# EAGLE design regelschaltplan (EAGLE 9.1.3)

## Sheet 1 of 5
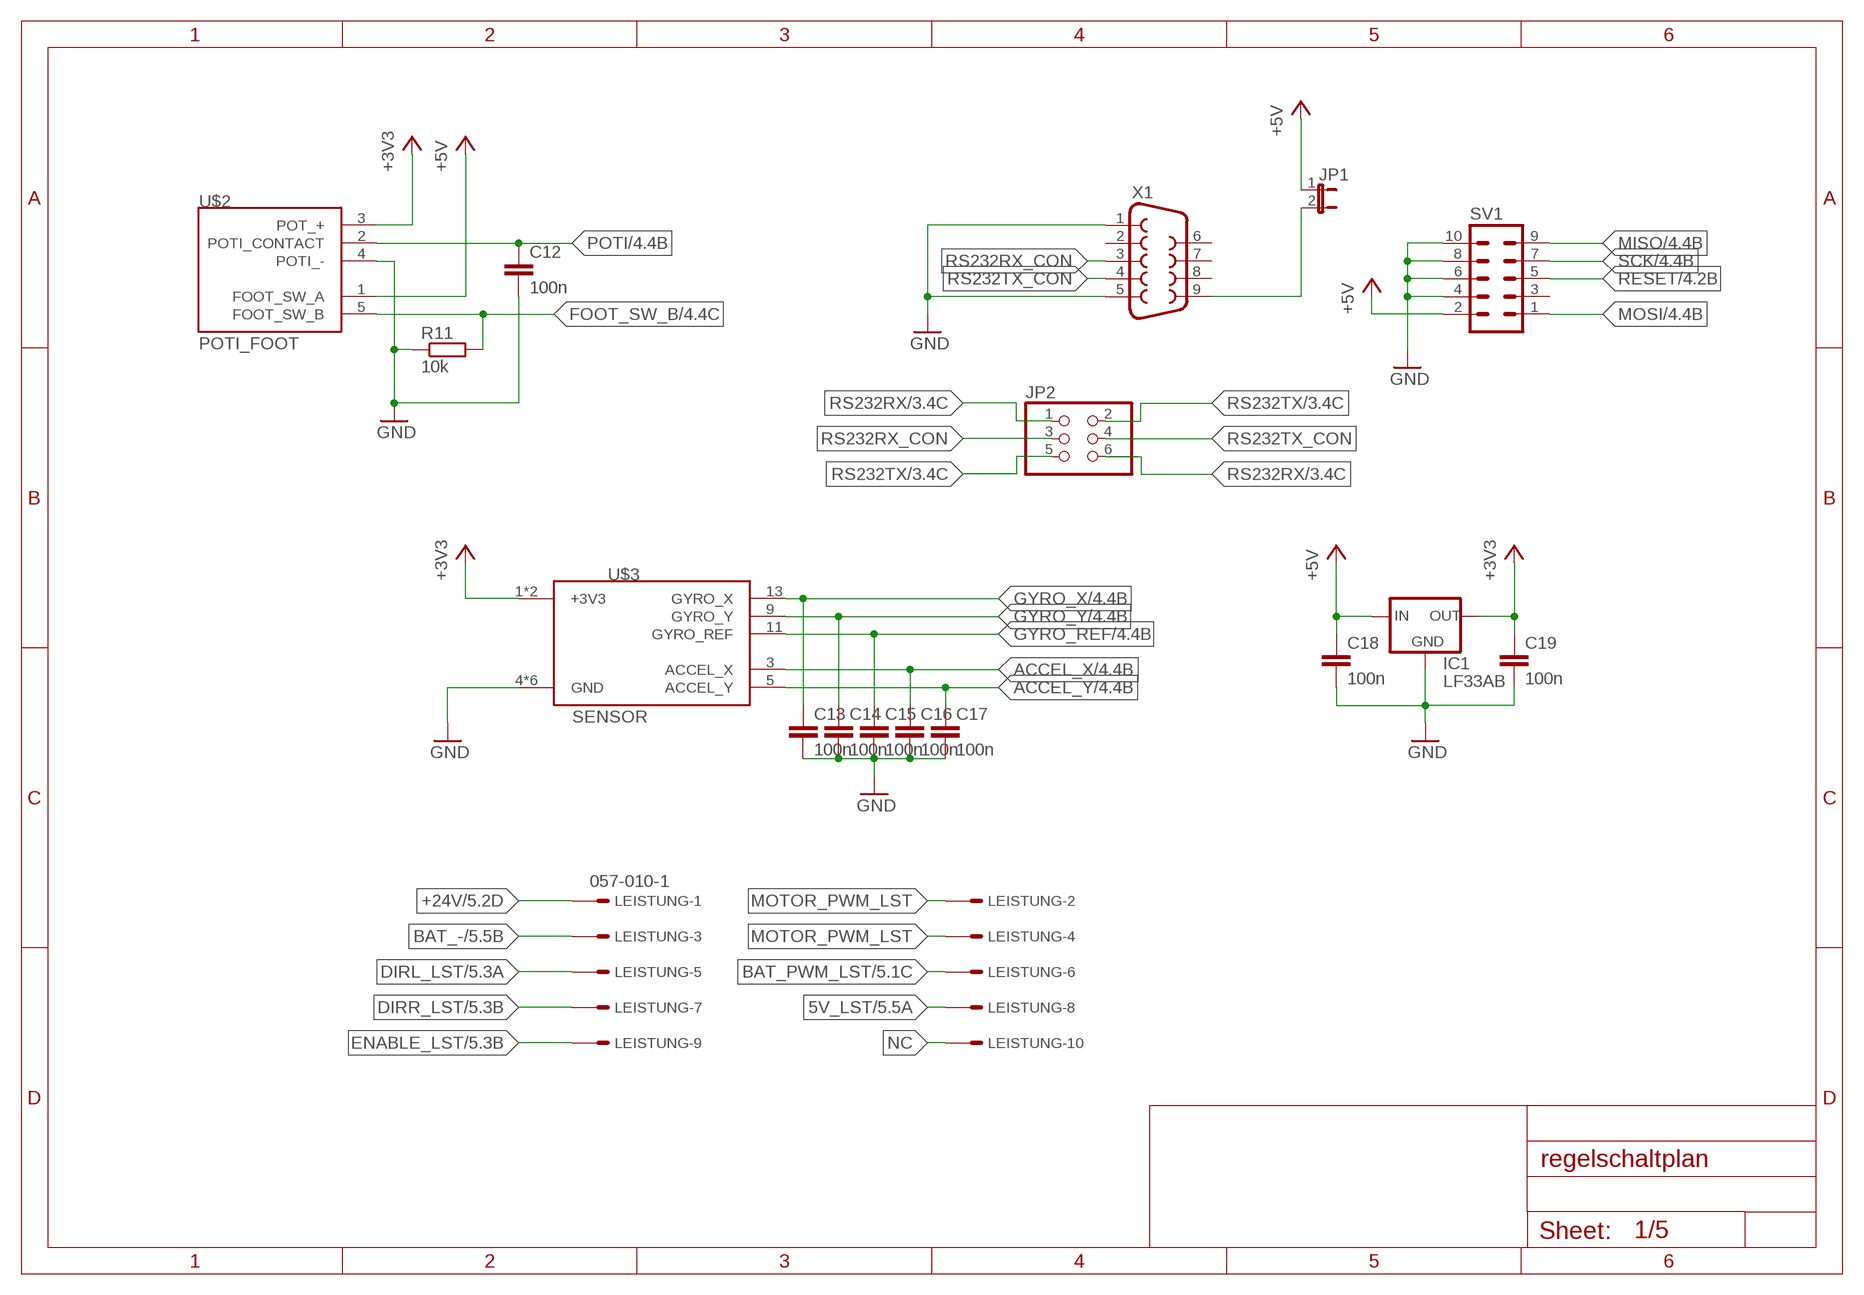
[diagram p0: schematic, sheet 1]

### Parts
C12  100n  C-EU025-025X050  [C025-025X050]
C13  100n  C-EU025-025X050  [C025-025X050]
C14  100n  C-EU025-025X050  [C025-025X050]
C15  100n  C-EU025-025X050  [C025-025X050]
C16  100n  C-EU025-025X050  [C025-025X050]
C17  100n  C-EU025-025X050  [C025-025X050]
C18  100n  C-EU025-025X050  [C025-025X050]
C19  100n  C-EU025-025X050  [C025-025X050]
IC1  LF33AB  [TO220]
JP1  JP1E  [JP1]
JP2  PINHD-2X3  [2X03]
LEISTUNG  057-010-1  [057-010-1]
R11  10k  R-EU_0207/7  [0207/7]
SV1  MA05-2  [MA05-2]
U$2  POTI_FOOT  [CON_6]
U$3  SENSOR  [CON_14]
X1  F09HP  [F09HP]

### Nets
5V_LST: LEISTUNG.8 ; also sheet 5
+3V3: C19.1 IC1.3(OUT) U$2.3(POT_+) U$3.1(+3V3) U$3.2(+3V3) ; also sheet 2,4
+5V: C18.1 IC1.1(IN) JP1.1 SV1.2 U$2.1(FOOT_SW_A) ; also sheet 2,3,4,5
+24V: LEISTUNG.1 ; also sheet 5
ACCEL_X: C16.1 U$3.3(ACCEL_X) ; also sheet 4
ACCEL_Y: C17.1 U$3.5(ACCEL_Y) ; also sheet 4
BAT_-: LEISTUNG.3 ; also sheet 5
BAT_PWM_LST: LEISTUNG.6 ; also sheet 5
DIRL_LST: LEISTUNG.5 ; also sheet 5
DIRR_LST: LEISTUNG.7 ; also sheet 5
ENABLE_LST: LEISTUNG.9 ; also sheet 5
FOOT_SW_B: R11.2 U$2.5(FOOT_SW_B) ; also sheet 4
GND: C12.2 C13.2 C14.2 C15.2 C16.2 C17.2 C18.2 C19.2 IC1.2(GND) R11.1 SV1.4 SV1.6 SV1.8 SV1.10 U$2.4(POTI_-) U$3.4(GND) U$3.6(GND) U$3.8(GND) U$3.10(GND) U$3.12(GND) U$3.14(GND) X1.1 X1.5 ; also sheet 2,3,4,5
GYRO_REF: C15.1 U$3.11(GYRO_REF) ; also sheet 4
GYRO_X: C13.1 U$3.13(GYRO_X) ; also sheet 4
GYRO_Y: C14.1 U$3.9(GYRO_Y) ; also sheet 4
MISO: SV1.9 ; also sheet 4
MOSI: SV1.1 ; also sheet 4
MOTOR_PWM_LST: LEISTUNG.2 LEISTUNG.4
N$45: JP1.2 X1.9
NC: LEISTUNG.10
POTI: C12.1 U$2.2(POTI_CONTACT) ; also sheet 4
RESET: SV1.5 ; also sheet 4
RS232RX: JP2.1 JP2.6 ; also sheet 3
RS232RX_CON: JP2.3 X1.3
RS232TX: JP2.2 JP2.5 ; also sheet 3
RS232TX_CON: JP2.4 X1.4
SCK: SV1.7 ; also sheet 4
Unconnected: SV1.3 X1.2 X1.6 X1.7 X1.8

## Sheet 2 of 5
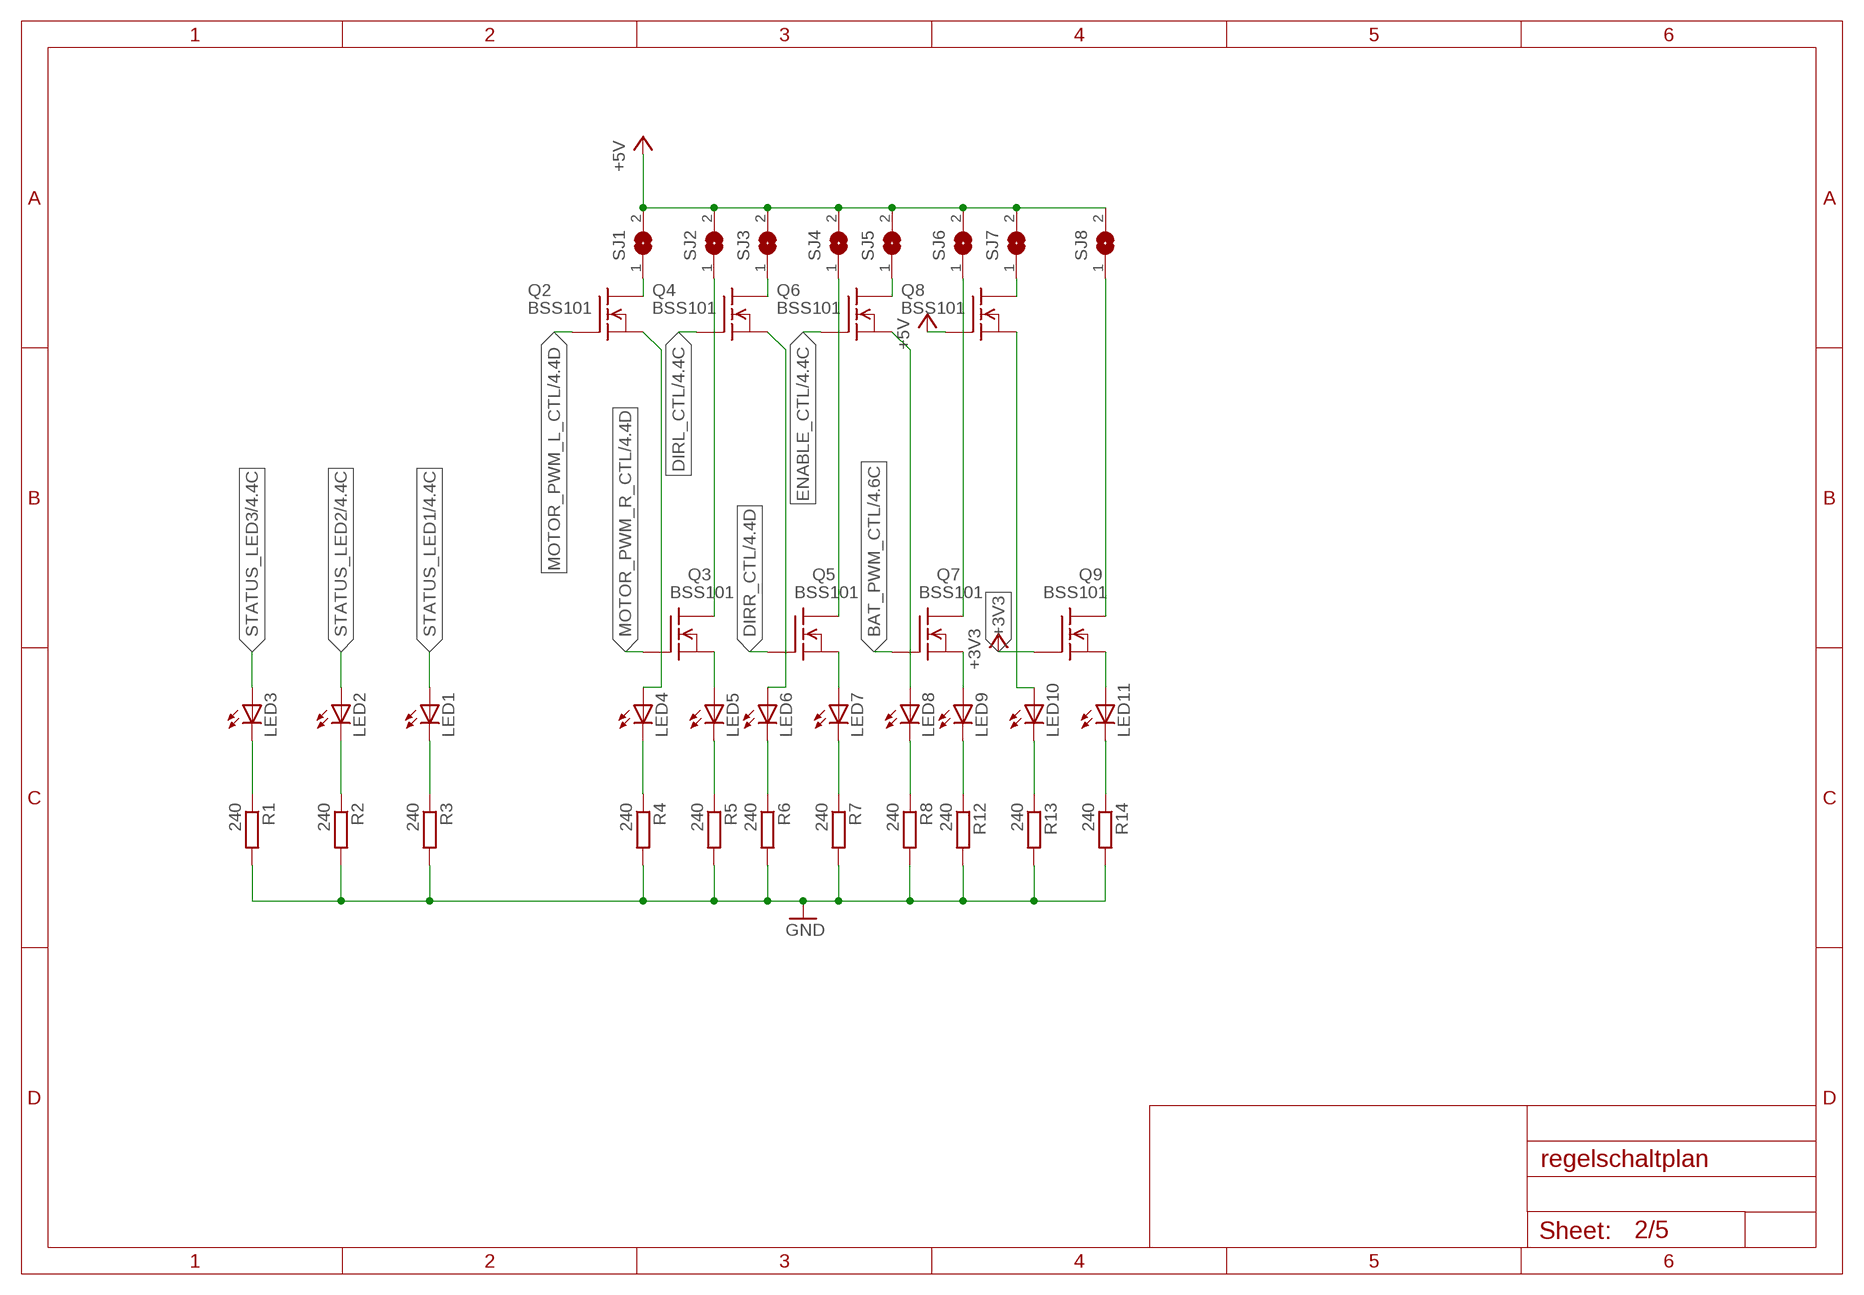
[diagram p1: schematic, sheet 2]

### Parts
LED1  LED3MM  [LED3MM]
LED2  LED3MM  [LED3MM]
LED3  LED3MM  [LED3MM]
LED4  LED3MM  [LED3MM]
LED5  LED3MM  [LED3MM]
LED6  LED3MM  [LED3MM]
LED7  LED3MM  [LED3MM]
LED8  LED3MM  [LED3MM]
LED9  LED3MM  [LED3MM]
LED10  LED3MM  [LED3MM]
LED11  LED3MM  [LED3MM]
Q2  BSS101  [TO92]
Q3  BSS101  [TO92]
Q4  BSS101  [TO92]
Q5  BSS101  [TO92]
Q6  BSS101  [TO92]
Q7  BSS101  [TO92]
Q8  BSS101  [TO92]
Q9  BSS101  [TO92]
R1  240  R-EU_0207/7  [0207/7]
R2  240  R-EU_0207/7  [0207/7]
R3  240  R-EU_0207/7  [0207/7]
R4  240  R-EU_0207/7  [0207/7]
R5  240  R-EU_0207/7  [0207/7]
R6  240  R-EU_0207/7  [0207/7]
R7  240  R-EU_0207/7  [0207/7]
R8  240  R-EU_0207/7  [0207/7]
R12  240  R-EU_0207/7  [0207/7]
R13  240  R-EU_0207/7  [0207/7]
R14  240  R-EU_0207/7  [0207/7]
SJ1  SJ  [SJ]
SJ2  SJ  [SJ]
SJ3  SJ  [SJ]
SJ4  SJ  [SJ]
SJ5  SJ  [SJ]
SJ6  SJ  [SJ]
SJ7  SJ  [SJ]
SJ8  SJ  [SJ]

### Nets
+3V3: Q9.2(G) ; also sheet 1,4
+5V: Q8.2(G) SJ1.2 SJ2.2 SJ3.2 SJ4.2 SJ5.2 SJ6.2 SJ7.2 SJ8.2 ; also sheet 1,3,4,5
BAT_PWM_CTL: Q7.2(G) ; also sheet 4,5
DIRL_CTL: Q4.2(G) ; also sheet 4,5
DIRR_CTL: Q5.2(G) ; also sheet 4,5
ENABLE_CTL: Q6.2(G) ; also sheet 4,5
GND: R1.2 R2.2 R3.2 R4.2 R5.2 R6.2 R7.2 R8.2 R12.2 R13.2 R14.2 ; also sheet 1,3,4,5
MOTOR_PWM_L_CTL: Q2.2(G) ; also sheet 4,5
MOTOR_PWM_R_CTL: Q3.2(G) ; also sheet 4,5
N$4: Q2.3(D) SJ1.1
N$7: LED4.K(C) R4.1
N$10: LED5.K(C) R5.1
N$11: LED6.K(C) R6.1
N$14: LED7.K(C) R7.1
N$15: LED8.K(C) R8.1
N$16: LED9.K(C) R12.1
N$17: LED10.K(C) R13.1
N$18: LED11.K(C) R14.1
N$19: Q9.3(D) SJ8.1
N$20: LED10.A Q8.1(S)
N$21: LED9.A Q7.1(S)
N$22: LED11.A Q9.1(S)
N$23: LED7.A Q5.1(S)
N$24: LED5.A Q3.1(S)
N$25: LED6.A Q4.1(S)
N$26: LED4.A Q2.1(S)
N$27: LED8.A Q6.1(S)
N$28: LED2.K(C) R2.1
N$29: LED3.K(C) R1.1
N$30: Q8.3(D) SJ7.1
N$31: Q7.3(D) SJ6.1
N$32: Q6.3(D) SJ5.1
N$33: Q5.3(D) SJ4.1
N$34: Q4.3(D) SJ3.1
N$35: Q3.3(D) SJ2.1
N$46: LED1.K(C) R3.1
STATUS_LED1: LED1.A ; also sheet 4
STATUS_LED2: LED2.A ; also sheet 4
STATUS_LED3: LED3.A ; also sheet 4

## Sheet 3 of 5
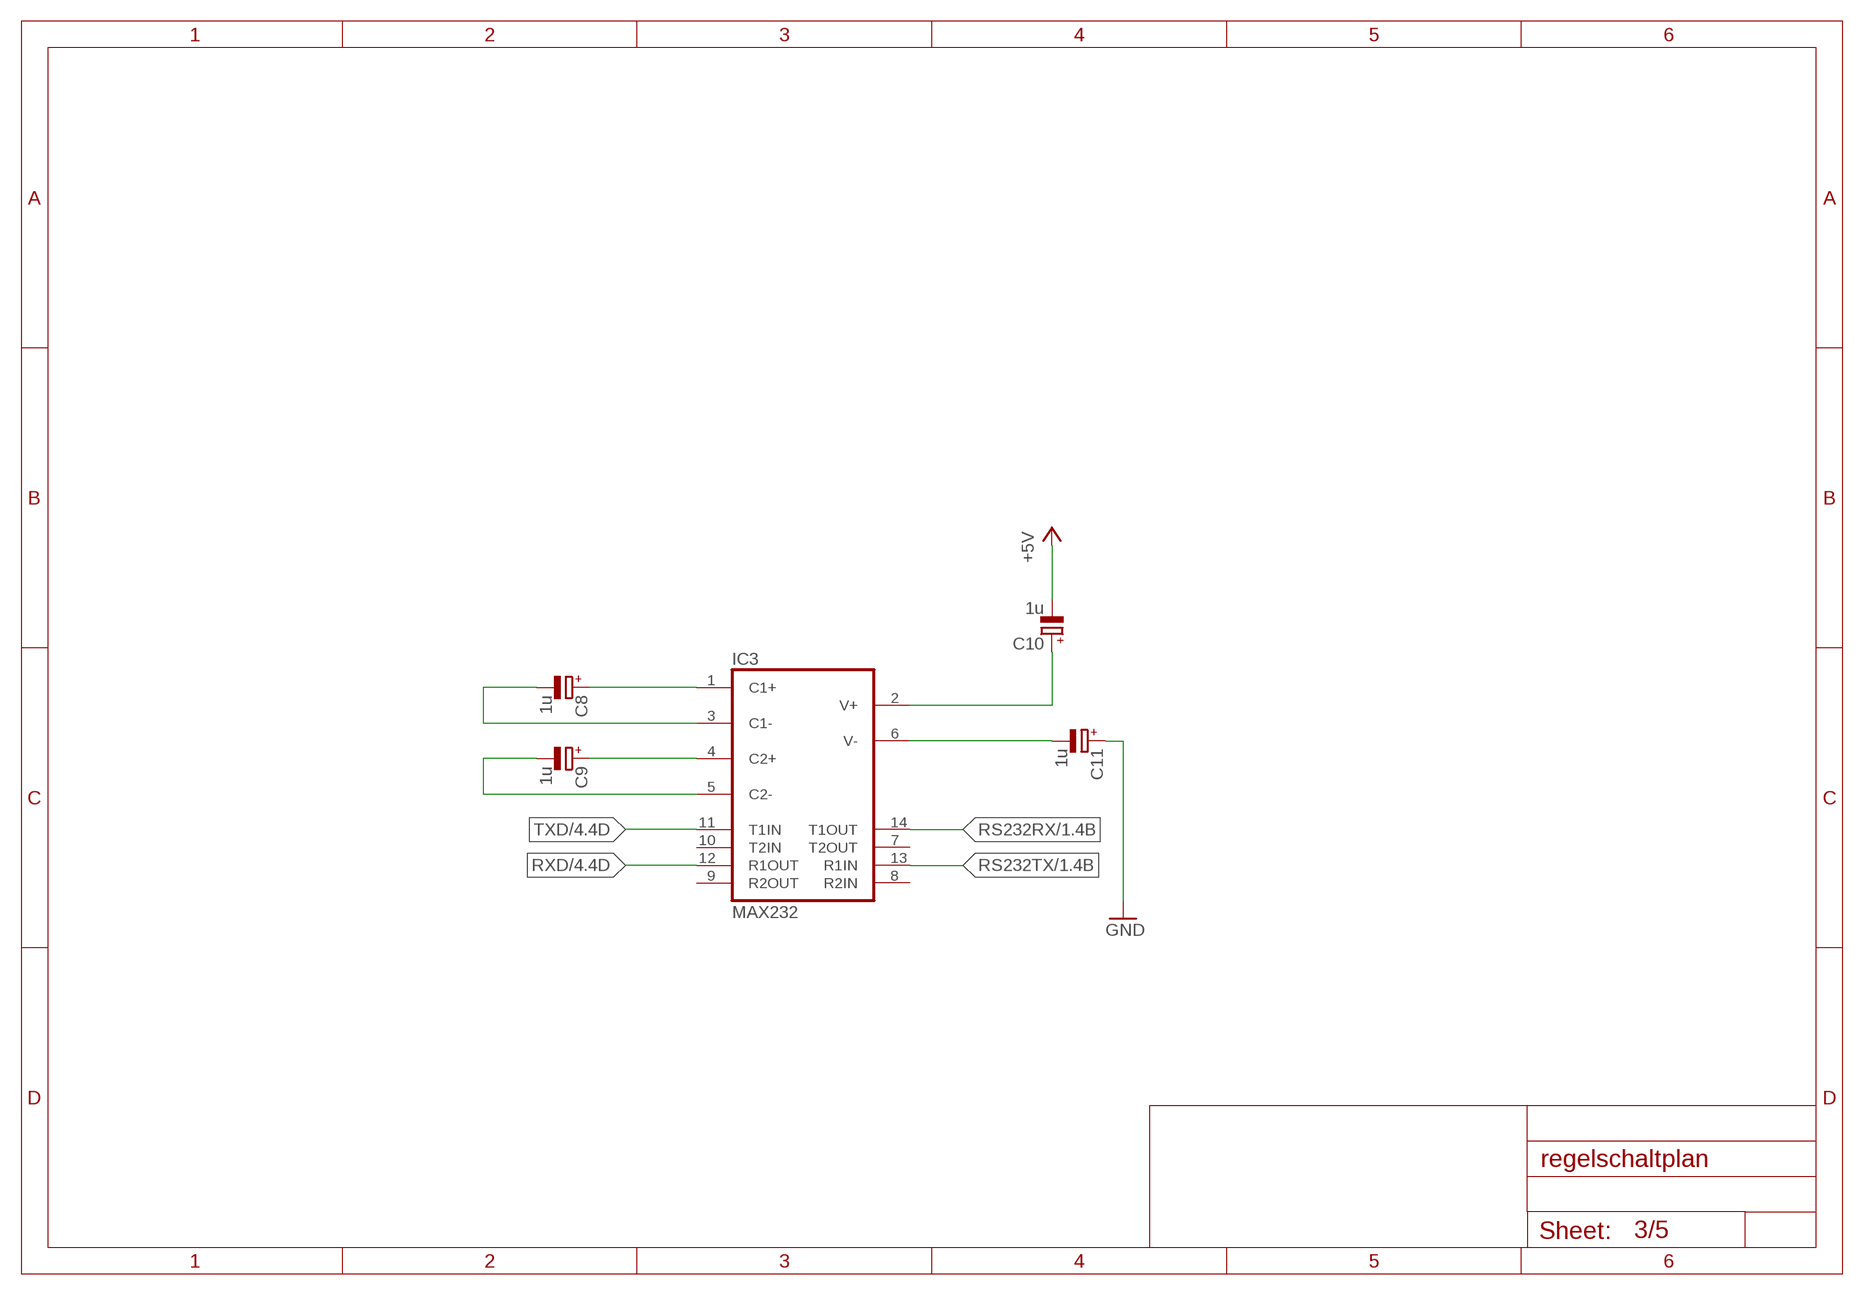
[diagram p2: schematic, sheet 3]

### Parts
C8  1u  CPOL-EUE2,5-6E  [E2,5-6E]
C9  1u  CPOL-EUE2,5-6E  [E2,5-6E]
C10  1u  CPOL-EUE2,5-6E  [E2,5-6E]
C11  1u  CPOL-EUE2,5-6E  [E2,5-6E]
IC3  MAX232  [DIL16]

### Nets
+5V: C10.- ; also sheet 1,2,4,5
GND: C11.+ ; also sheet 1,2,4,5
N$1: C8.+ IC3.1(C1+)
N$5: C8.- IC3.3(C1-)
N$6: C9.+ IC3.4(C2+)
N$8: C10.+ IC3.2(V+)
N$9: C11.- IC3.6(V-)
RS232RX: IC3.14(T1OUT) ; also sheet 1
RS232TX: IC3.13(R1IN) ; also sheet 1
RXD: IC3.12(R1OUT) ; also sheet 4
TXD: C9.- IC3.5(C2-) IC3.11(T1IN) ; also sheet 4
Unconnected: IC3.7(T2OUT) IC3.8(R2IN) IC3.9(R2OUT) IC3.10(T2IN)

## Sheet 4 of 5
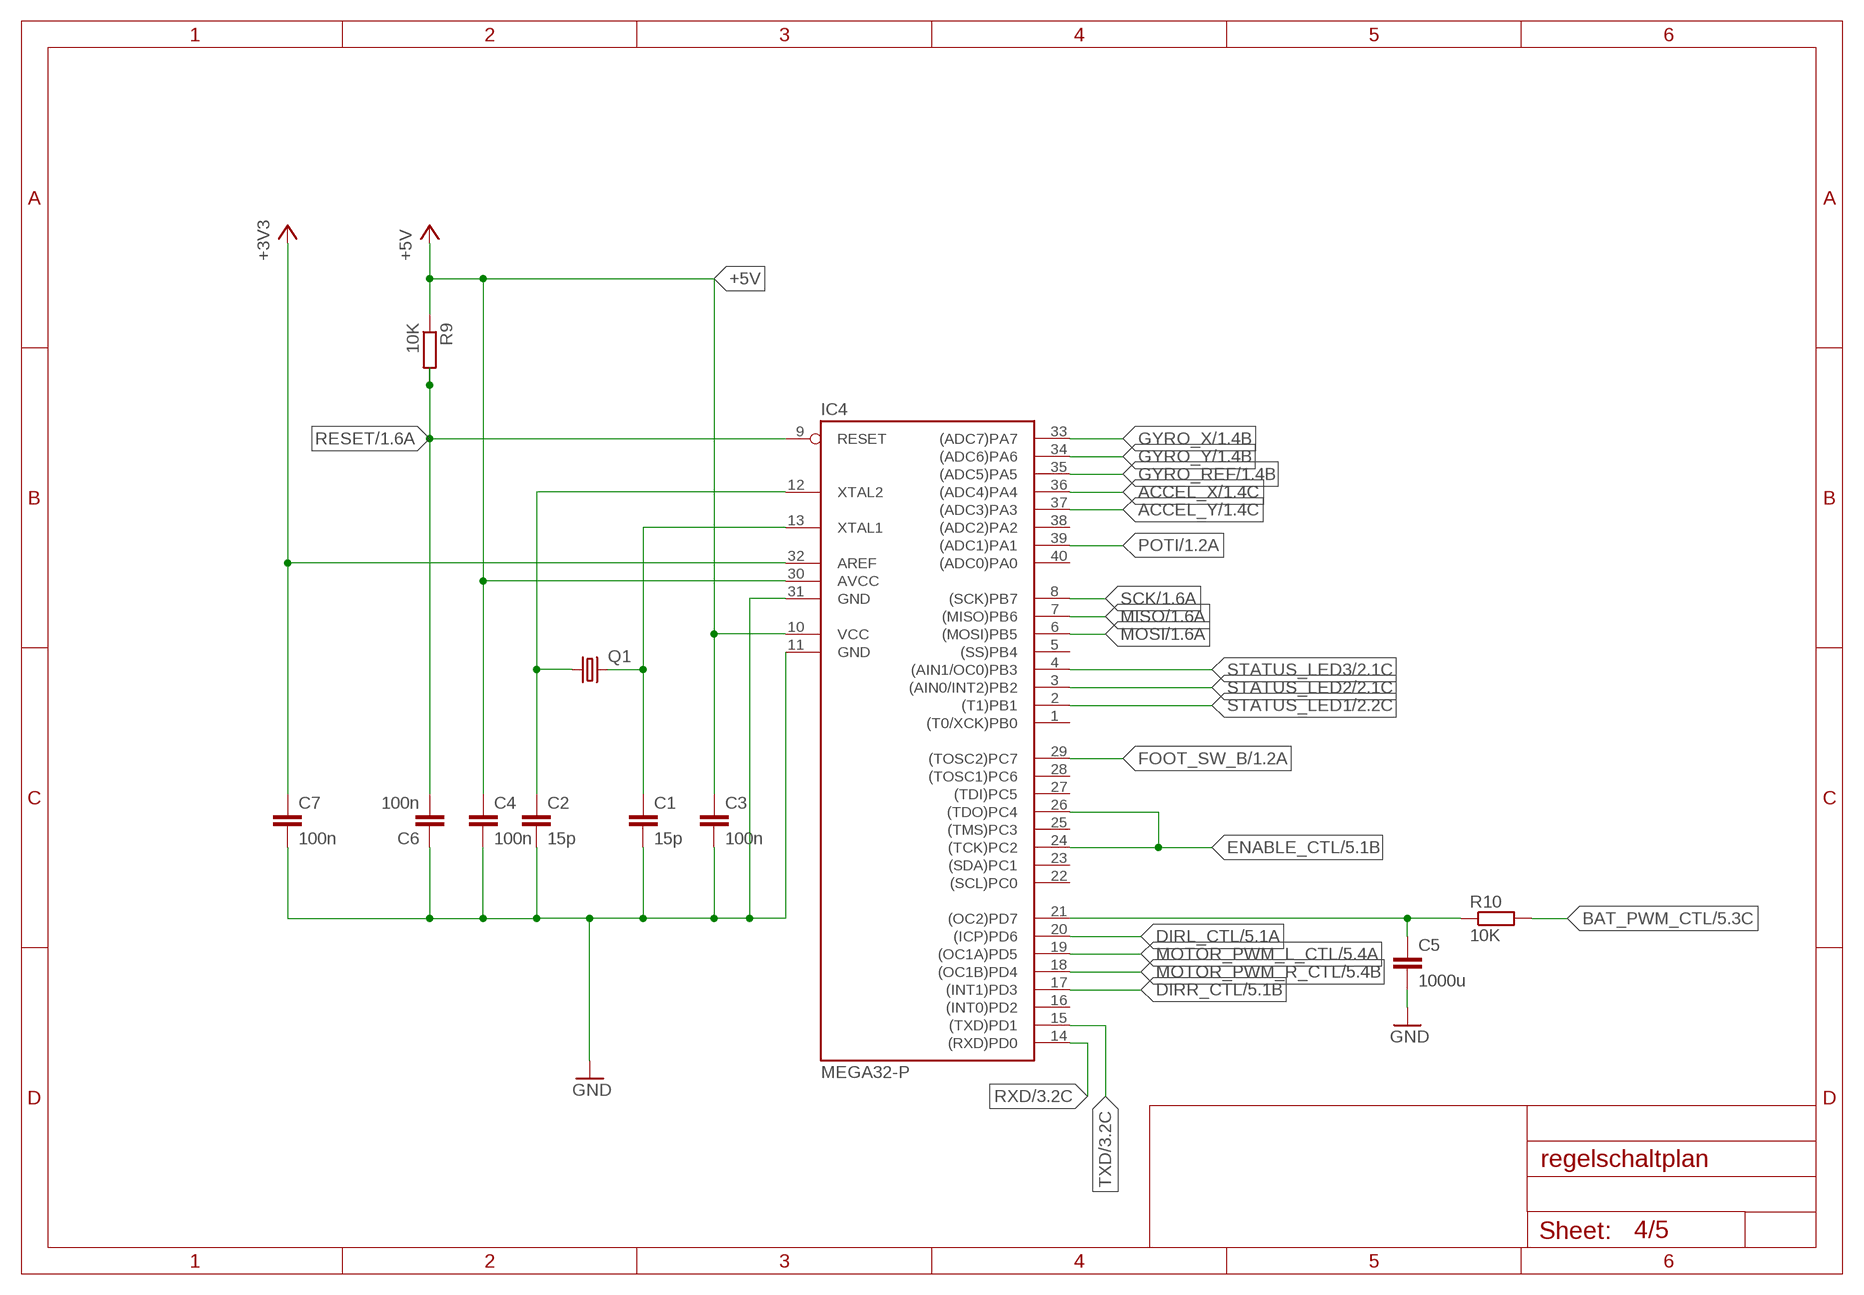
[diagram p3: schematic, sheet 4]

### Parts
C1  15p  C-EU025-025X050  [C025-025X050]
C2  15p  C-EU025-025X050  [C025-025X050]
C3  100n  C-EU025-025X050  [C025-025X050]
C4  100n  C-EU025-025X050  [C025-025X050]
C5  1000u  C-EU025-025X050  [C025-025X050]
C6  100n  C-EU025-025X050  [C025-025X050]
C7  100n  C-EU025-025X050  [C025-025X050]
IC4  MEGA32-P  [DIL40]
Q1  CRYSTALHC49U-V  [HC49U-V]
R9  10K  R-EU_0207/7  [0207/7]
R10  10K  R-EU_0207/7  [0207/7]

### Nets
+3V3: C7.1 IC4.32(AREF) ; also sheet 1,2
+5V: C3.1 C4.1 IC4.10(VCC) IC4.30(AVCC) R9.1 ; also sheet 1,2,3,5
ACCEL_X: IC4.36((ADC4)PA4) ; also sheet 1
ACCEL_Y: IC4.37((ADC3)PA3) ; also sheet 1
BAT_PWM_CTL: R10.2 ; also sheet 2,5
DIRL_CTL: IC4.20((ICP)PD6) ; also sheet 2,5
DIRR_CTL: IC4.17((INT1)PD3) ; also sheet 2,5
ENABLE_CTL: IC4.24((TCK)PC2) IC4.26((TDO)PC4) ; also sheet 2,5
FOOT_SW_B: IC4.29((TOSC2)PC7) ; also sheet 1
GND: C1.2 C2.2 C3.2 C4.2 C5.2 C6.1 C7.2 IC4.11(GND) IC4.31(GND) ; also sheet 1,2,3,5
GYRO_REF: IC4.35((ADC5)PA5) ; also sheet 1
GYRO_X: IC4.33((ADC7)PA7) ; also sheet 1
GYRO_Y: IC4.34((ADC6)PA6) ; also sheet 1
MISO: IC4.7((MISO)PB6) ; also sheet 1
MOSI: IC4.6((MOSI)PB5) ; also sheet 1
MOTOR_PWM_L_CTL: IC4.19((OC1A)PD5) ; also sheet 2,5
MOTOR_PWM_R_CTL: IC4.18((OC1B)PD4) ; also sheet 2,5
N$2: C2.1 IC4.12(XTAL2) Q1.1
N$3: C1.1 IC4.13(XTAL1) Q1.2
N$47: C5.1 IC4.21((OC2)PD7) R10.1
POTI: IC4.39((ADC1)PA1) ; also sheet 1
RESET: C6.2 IC4.9(RESET) R9.2 ; also sheet 1
RXD: IC4.14((RXD)PD0) ; also sheet 3
SCK: IC4.8((SCK)PB7) ; also sheet 1
STATUS_LED1: IC4.2((T1)PB1) ; also sheet 2
STATUS_LED2: IC4.3((AIN0/INT2)PB2) ; also sheet 2
STATUS_LED3: IC4.4((AIN1/OC0)PB3) ; also sheet 2
TXD: IC4.15((TXD)PD1) ; also sheet 3
Unconnected: IC4.1((T0/XCK)PB0) IC4.5((SS)PB4) IC4.16((INT0)PD2) IC4.22((SCL)PC0) IC4.23((SDA)PC1) IC4.25((TMS)PC3) IC4.27((TDI)PC5) IC4.28((TOSC1)PC6) IC4.38((ADC2)PA2) IC4.40((ADC0)PA0)

## Sheet 5 of 5: galvanic decoupling
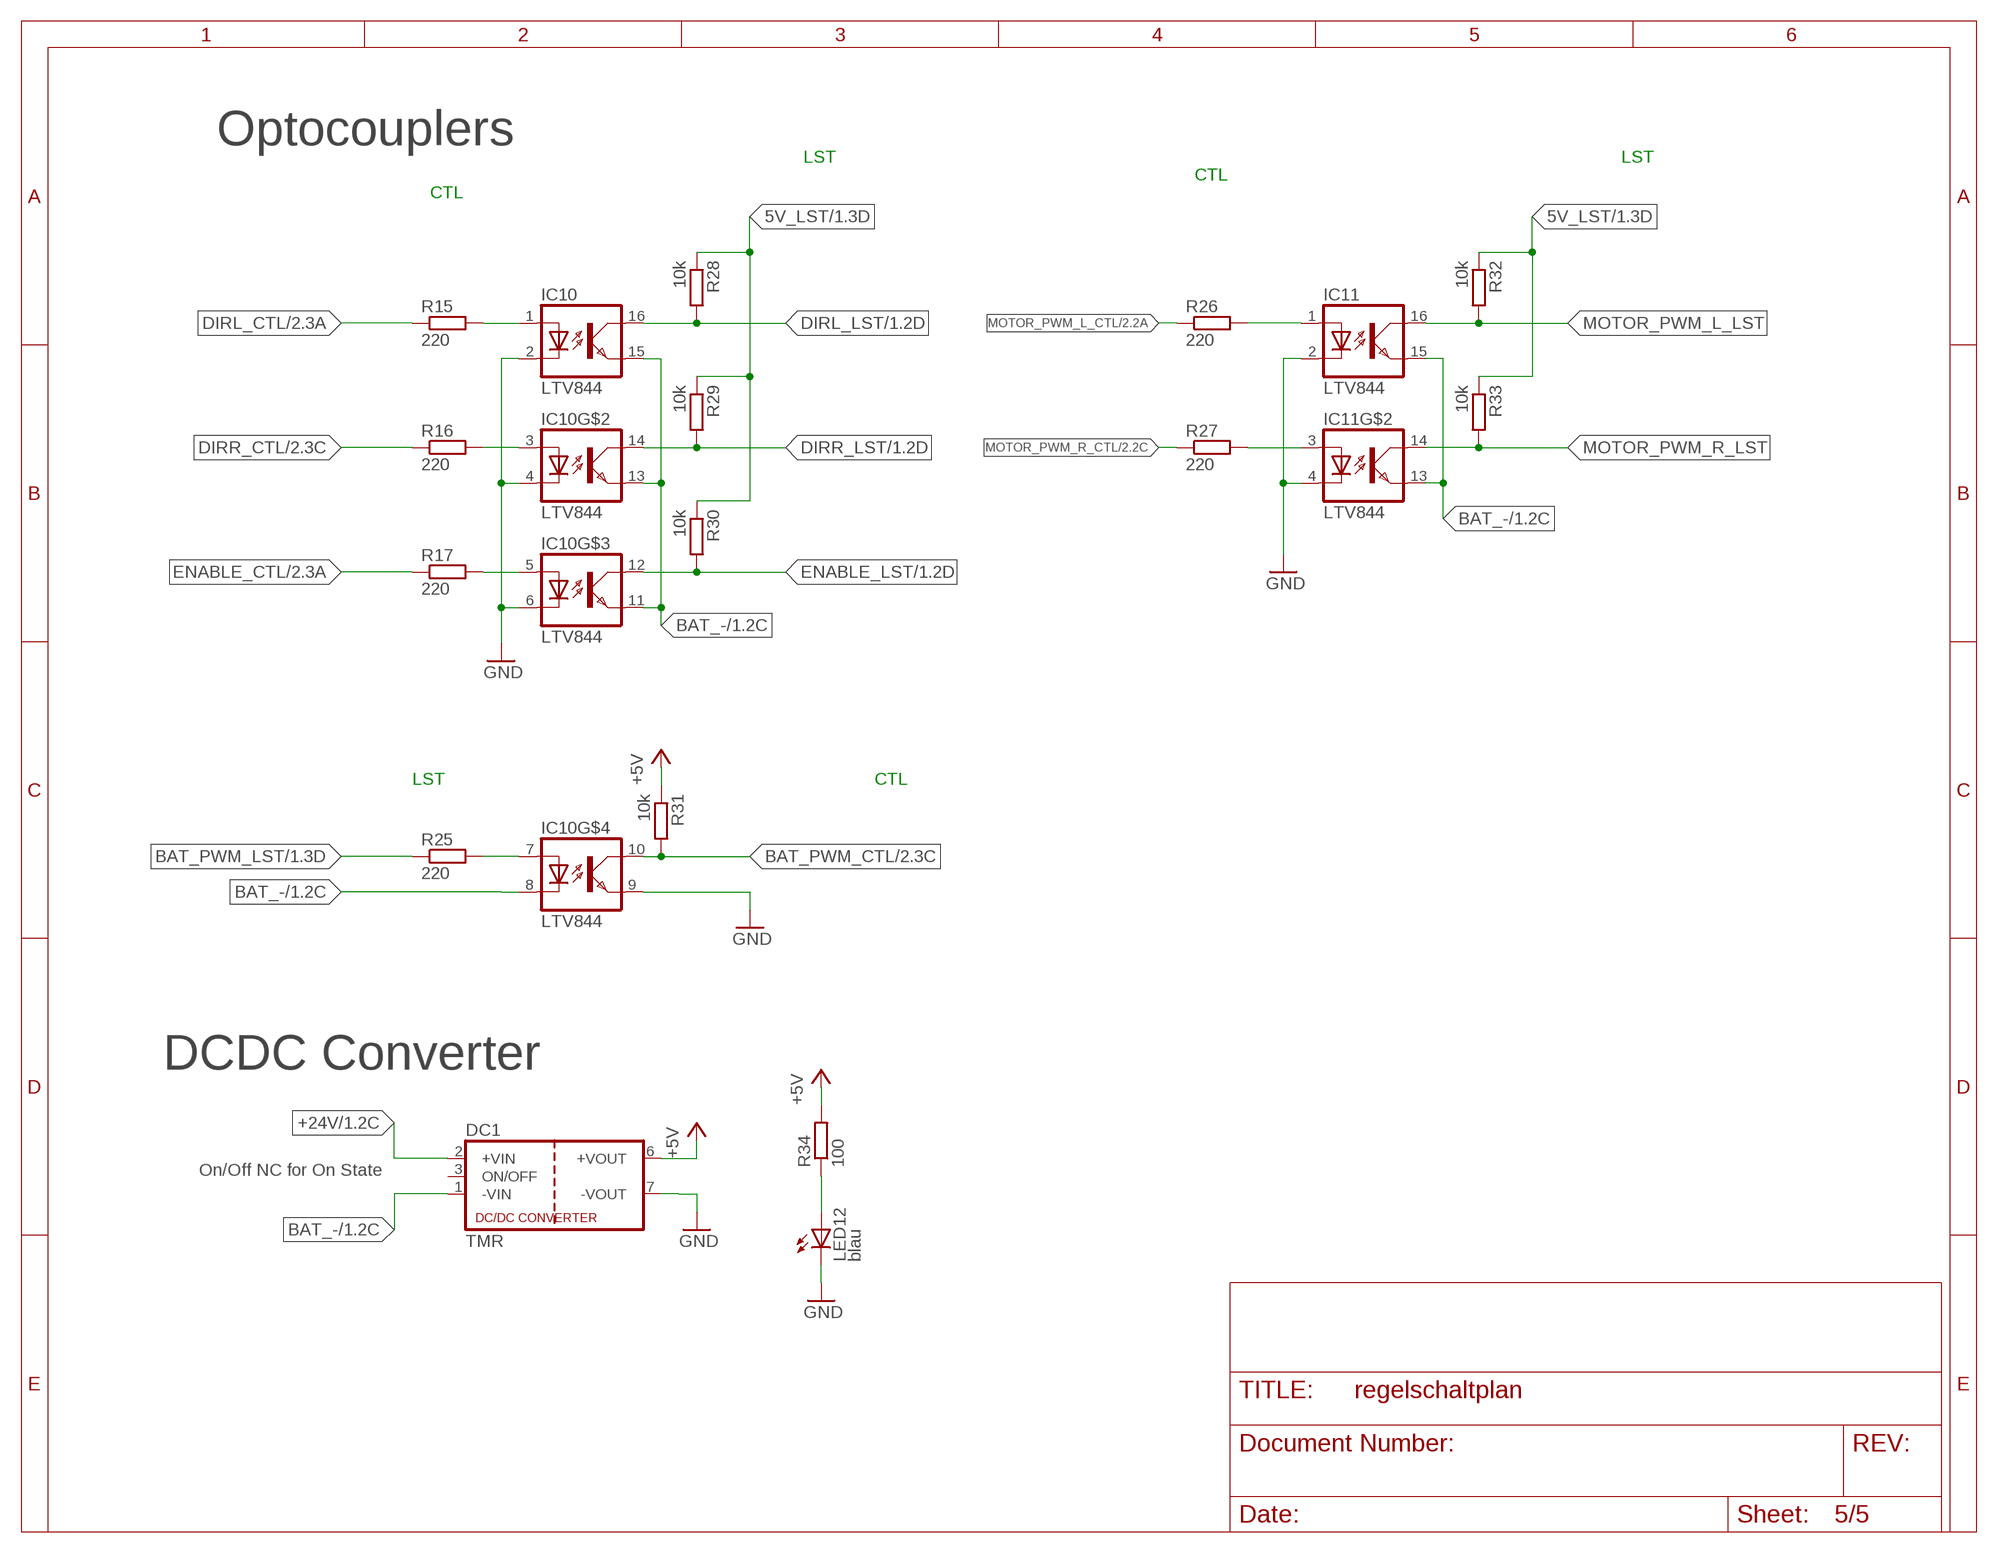
[diagram p4: schematic, sheet 5]

### Parts
DC1  TMR  [TRACO_SIP-8]
IC10  LTV844  [DIL16]
IC11  LTV844  [DIL16]
LED12  blau  LED3MM  [LED3MM]
R15  220  R-EU_0207/10  [0207/10]
R16  220  R-EU_0207/10  [0207/10]
R17  220  R-EU_0207/10  [0207/10]
R25  220  R-EU_0207/10  [0207/10]
R26  220  R-EU_0207/10  [0207/10]
R27  220  R-EU_0207/10  [0207/10]
R28  10k  R-EU_0207/10  [0207/10]
R29  10k  R-EU_0207/10  [0207/10]
R30  10k  R-EU_0207/10  [0207/10]
R31  10k  R-EU_0207/10  [0207/10]
R32  10k  R-EU_0207/10  [0207/10]
R33  10k  R-EU_0207/10  [0207/10]
R34  100  R-EU_0207/10  [0207/10]

### Nets
5V_LST: R28.1 R29.1 R30.1 R32.1 R33.1 ; also sheet 1
+5V: DC1.6(+VOUT) R31.1 R34.2 ; also sheet 1,2,3,4
+24V: DC1.2(+VIN) ; also sheet 1
BAT_-: DC1.1(-VIN) IC10.8(C) IC10.11(EMIT) IC10.13(EMIT) IC10.15(EMIT) IC11.13(EMIT) IC11.15(EMIT) ; also sheet 1
BAT_PWM_CTL: IC10.10(COL) R31.2 ; also sheet 2,4
BAT_PWM_LST: R25.1 ; also sheet 1
DIRL_CTL: R15.1 ; also sheet 2,4
DIRL_LST: IC10.16(COL) R28.2 ; also sheet 1
DIRR_CTL: R16.1 ; also sheet 2,4
DIRR_LST: IC10.14(COL) R29.2 ; also sheet 1
ENABLE_CTL: R17.1 ; also sheet 2,4
ENABLE_LST: IC10.12(COL) R30.2 ; also sheet 1
GND: DC1.7(-VOUT) IC10.2(C) IC10.4(C) IC10.6(C) IC10.9(EMIT) IC11.2(C) IC11.4(C) LED12.K(C) ; also sheet 1,2,3,4
MOTOR_PWM_L_CTL: R26.1 ; also sheet 2,4
MOTOR_PWM_L_LST: IC11.16(COL) R32.2
MOTOR_PWM_R_CTL: R27.1 ; also sheet 2,4
MOTOR_PWM_R_LST: IC11.14(COL) R33.2
N$36: IC10.1(A) R15.2
N$37: IC10.3(A) R16.2
N$38: IC10.5(A) R17.2
N$39: IC10.7(A) R25.2
N$40: IC11.3(A) R27.2
N$41: IC11.1(A) R26.2
N$42: LED12.A R34.1
Unconnected: DC1.3(ON/OFF) IC11.5(A) IC11.6(C) IC11.7(A) IC11.8(C) IC11.9(EMIT) IC11.10(COL) IC11.11(EMIT) IC11.12(COL)

### Notes on the sheet
- Optocouplers
- LST | LST
- CTL
- CTL
- LST | CTL
- DCDC Converter
- On/Off NC for On State

## Power pins joined to a net without a drawn wire
GND: IC3.15(GND)
VCC: IC3.16(VCC)

## Library data of the parts
C1-C7 C12-C19 = rcl:C-EU: CAPACITOR, European symbol
C8-C11 = rcl:CPOL-EU: POLARIZED CAPACITOR, European symbol
DC1 = traco_tmr:TMR
IC1 = lsd2016:LF33AB
IC3 = maxim:MAX232: RS232 TRANSCEIVER; MF: MAXIM; MPN: MAX232ACPE+; OC_FARNELL: 9723773; OC_NEWARK: 68K4544
IC4 = atmel:MEGA32-P: MICROCONTROLLER 32 Kbytes FLASH 2 Kbytes SRAM 1 Kbytes EEPROM USART 8-channel 10 bit ADC Source: www.atmel.com .. doc2503.pdf; MPN: ATMEGA32-16PU; OC_FARNELL: 1661729; OC_NEWARK: 51P1794
IC10 IC11 = lsd2016:LTV844
JP1 = jumper:JP1E: JUMPER
JP2 = pinhead:PINHD-2X3: PIN HEADER
LED1-LED12 = led:LED: LED OSRAM: - CHIPLED LG R971, LG N971, LY N971, LG Q971, LY Q971, LO R971, LY R971 LH N974, LH R974 LS Q976, LO Q976, LY Q976 LO Q996 - Hyper CHIPLED LW Q18S LB Q993, LB Q99A, LB R99A - SideLED LS A670, LO A670, LY A670, LG A670, LP A670 LB A673, LV A673, LT A673, LW A673 LH A674 LY A675 LS A676, LA A676, LO A676, LY A676, LW A676 LS A679, LY A679, LG A679 - Hyper Micro SIDELED® LS Y876, LA Y876, LO Y876, LY Y876 LT Y87S - SmartLED LW L88C, LW L88S LB L89C, LB L89S, LG L890 LS L89K, LO L89K, LY L89K LS L896, LA L896, LO L896, LY L896 - TOPLED LS T670, LO T670, LY T670, LG T670, LP T670 LSG T670, LSP T670, LSY T670, LOP T670, LYG T670 LG T671, LOG T671, LSG T671 LB T673, LV T673, LT T673, LW T673 LH T674 LS T676, LA T676, LO T676, LY T676, LB T676, LH T676, LSB T676, LW T676 LB T67C, LV T67C, LT T67C, LS T67K, LO T67K, LY T67K, LW E67C LS E67B, LA E67B, LO E67B, LY E67B, LB E67C, LV E67C, LT E67C LW T67C LS T679, LY T679, LG T679 LS T770, LO T770, LY T770, LG T770, LP T770 LB T773, LV T773, LT T773, LW T773 LH T774 LS E675, LA E675, LY E675, LS T675 LS T776, LA T776, LO T776, LY T776, LB T776 LHGB T686 LT T68C, LB T68C - Hyper Mini TOPLED® LB M676 - Mini TOPLED Santana® LG M470 LS M47K, LO M47K, LY M47K Source: http://www.osram.convergy.de LUXEON: - LUMILED® LXK2-PW12-R00, LXK2-PW12-S00, LXK2-PW14-U00, LXK2-PW14-V00 LXK2-PM12-R00, LXK2-PM12-S00, LXK2-PM14-U00 LXK2-PE12-Q00, LXK2-PE12-R00, LXK2-PE12-S00, LXK2-PE14-T00, LXK2-PE14-U00 LXK2-PB12-K00, LXK2-PB12-L00, LXK2-PB12-M00, LXK2-PB14-N00, LXK2-PB14-P00, LXK2-PB14-Q00 LXK2-PR12-L00, LXK2-PR12-M00, LXK2-PR14-Q00, LXK2-PR14-R00 LXK2-PD12-Q00, LXK2-PD12-R00, LXK2-PD12-S00 LXK2-PH12-R00, LXK2-PH12-S00 LXK2-PL12-P00, LXK2-PL12-Q00, LXK2-PL12-R00 Source: www.luxeon.com KINGBRIGHT: KA-3528ASYC Source: www.kingbright.com
LEISTUNG = con-panduit:057-010-: CONNECTOR 10-pin series 057 contact pc board low profile headers; OC_FARNELL: unknown; OC_NEWARK: unknown
Q1 = crystal:CRYSTAL: CRYSTAL; OC_FARNELL: 1666969; OC_NEWARK: unknown
Q2-Q9 = transistor-fet:BSS101: N-Channel Enhancement MOSFET 200V; 0,16A; 11Ohm
R1-R17 R25-R34 = rcl:R-EU_: RESISTOR, European symbol
SJ1-SJ8 = jumper:SJ: SMD solder JUMPER
SV1 = con-lstb:MA05-2: PIN HEADER; OC_FARNELL: unknown; OC_NEWARK: unknown
U$2 = lsd2016:POTI_FOOT
U$3 = lsd2016:SENSOR
X1 = con-subd:F09: SUB-D; OC_FARNELL: unknown; OC_NEWARK: unknown

## Board
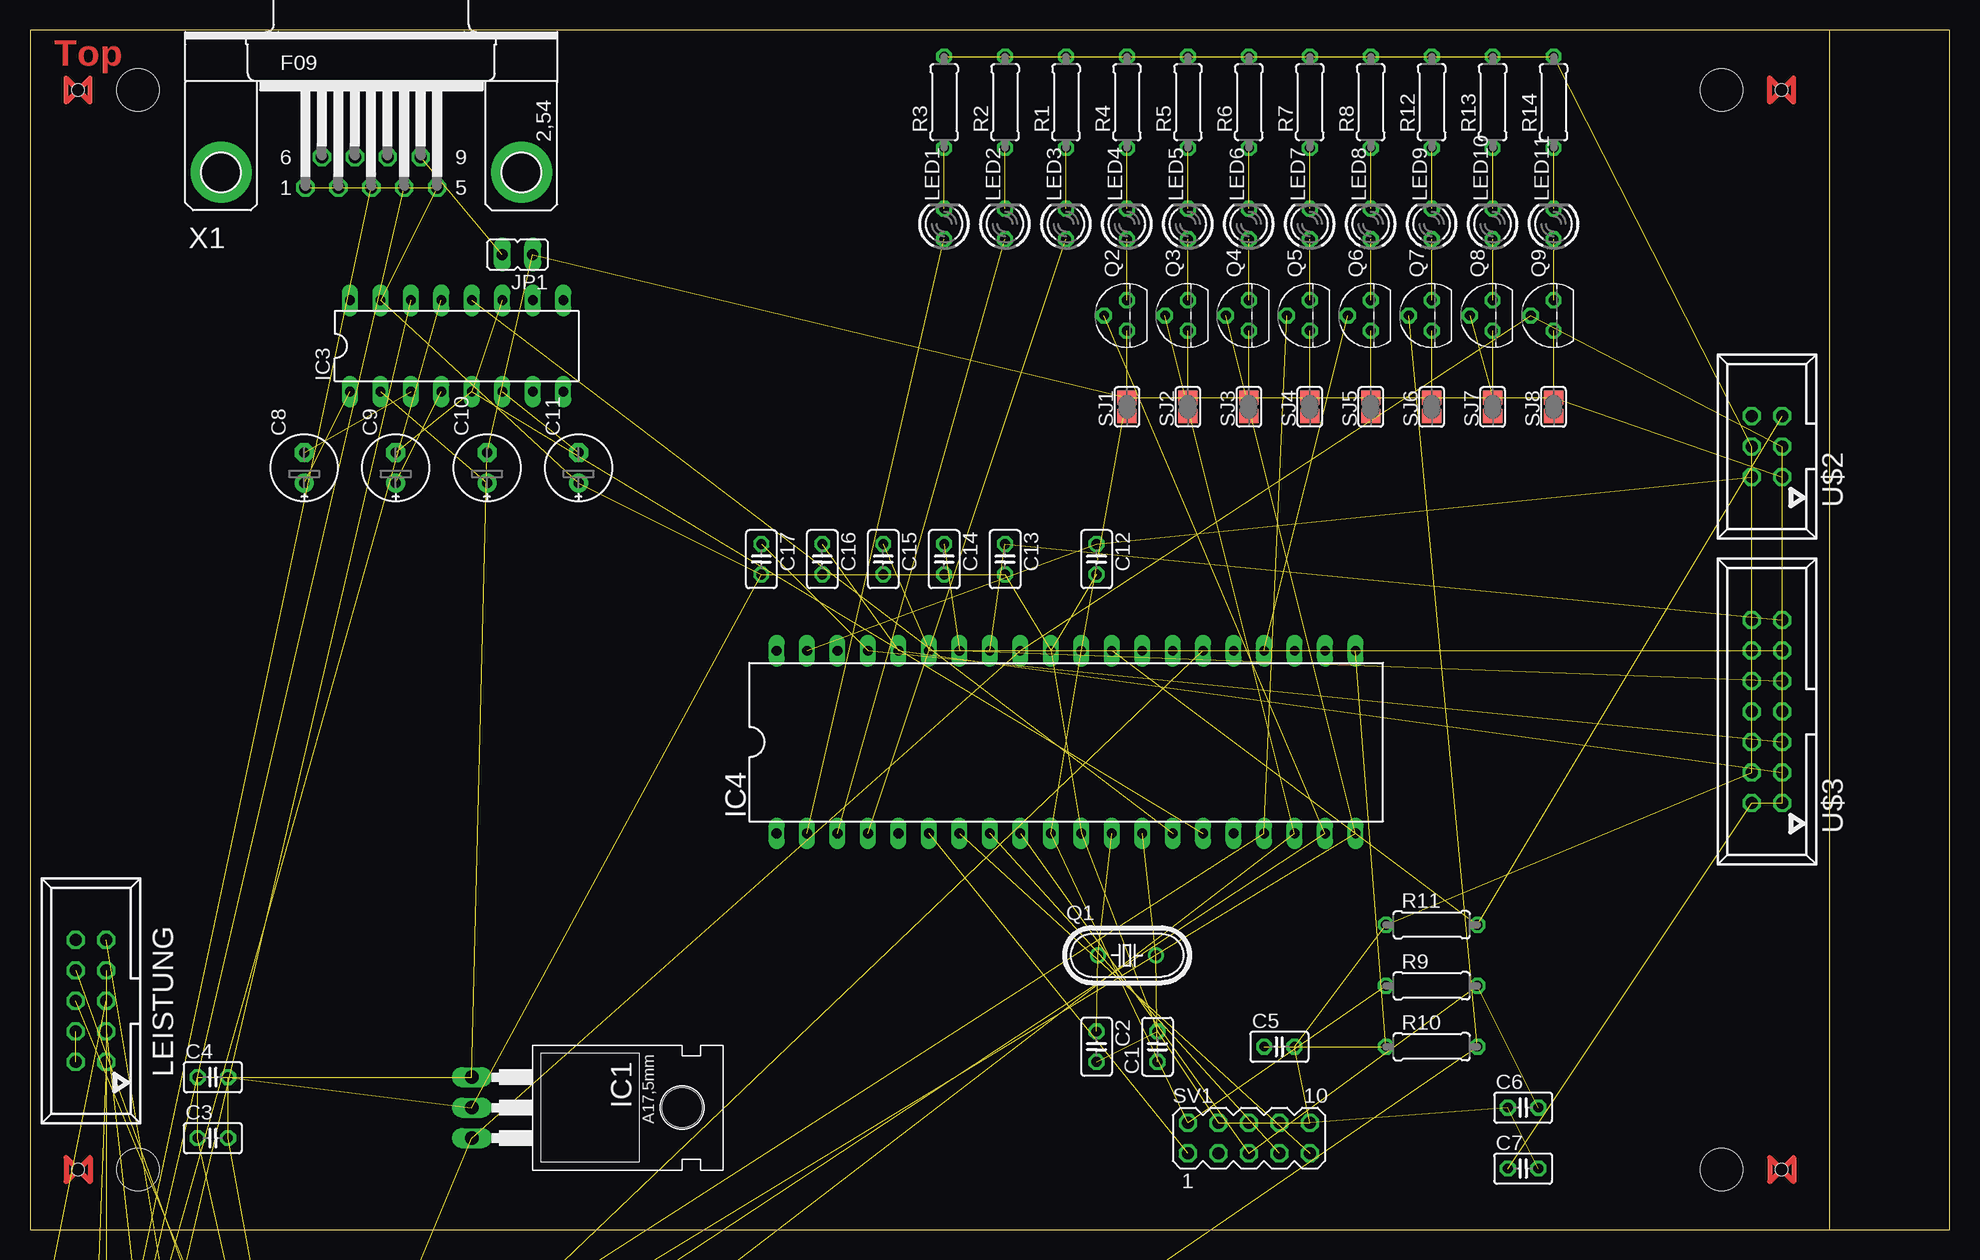
[diagram p5: board, top side]
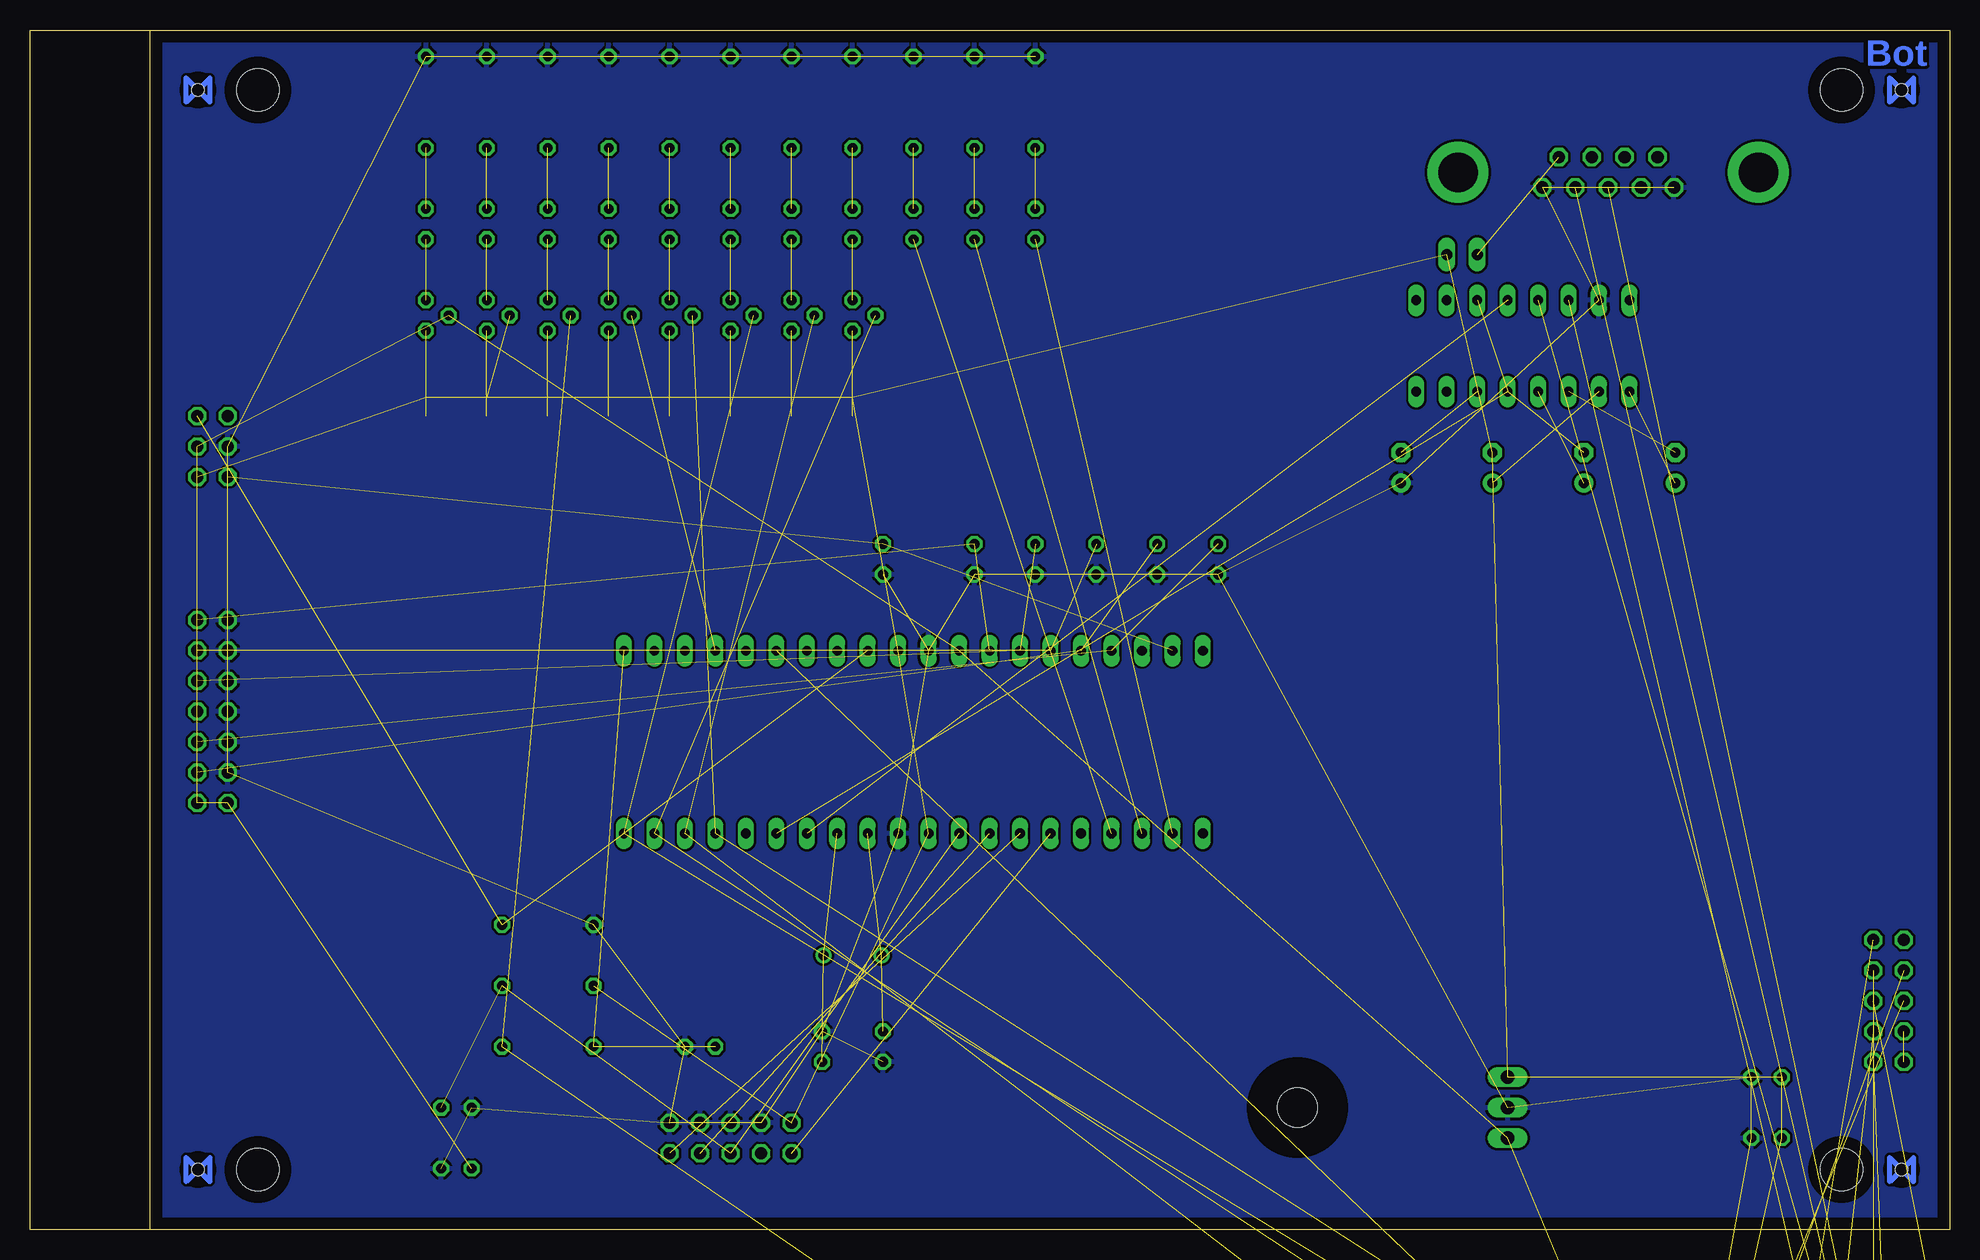
[diagram p6: board, bottom side, seen from below]

Size 160 x 100 mm. Coordinates in mm from the lower left corner, seen from the top.
Outline: 0,0 160,0 160,100 0,100 0,0
Copper layers (1*16): Top 0.035mm / dielectric 1.5mm / Bottom 0.035mm
Design rules "default": minimum track width 10mil, minimum drill 24mil, track to track 8mil, track to pad 8mil, pad to pad 8mil, via to via 8mil, smd to smd 8mil, copper to edge 40mil, drill to drill 8mil, minimum pad ring 10mil, minimum via ring 8mil, stop-mask expansion 4mil, vias tented up to drill 0mil, thermal gap 10mil

### Footprints (pad centres in the part's own frame; a part is rotated, then mirrored left to right if it is on the bottom)
C025-025X050 = drill 0.813 octagon: 1 -1.27,0; 2 1.27,0
E2,5-6E = drill 0.813 pad 1.575: + -1.27,0 | drill 0.813 pad 1.575 octagon: - 1.27,0
TRACO_SIP-8 = drill 0.7 long: 1 -8.89,0; 2 -6.35,0; 3 -3.81,0; 5 1.27,0; 6 3.81,0; 7 6.35,0; 8 8.89,0
TO220 = drill 1.118 long: 1 -2.54,-6.35; 2 0,-6.35; 3 2.54,-6.35 | hole 3.302: 0,11.176
DIL16 = drill 0.813 long: 1 -8.89,-3.81; 2 -6.35,-3.81; 3 -3.81,-3.81; 4 -1.27,-3.81; 5 1.27,-3.81; 6 3.81,-3.81; 7 6.35,-3.81; 8 8.89,-3.81; 9 8.89,3.81; 10 6.35,3.81; 11 3.81,3.81; 12 1.27,3.81; 13 -1.27,3.81; 14 -3.81,3.81; 15 -6.35,3.81; 16 -8.89,3.81
DIL40 = drill 0.813 long: 1 -24.13,-7.62; 2 -21.59,-7.62; 3 -19.05,-7.62; 4 -16.51,-7.62; 5 -13.97,-7.62; 6 -11.43,-7.62; 7 -8.89,-7.62; 8 -6.35,-7.62; 9 -3.81,-7.62; 10 -1.27,-7.62; 11 1.27,-7.62; 12 3.81,-7.62; 13 6.35,-7.62; 14 8.89,-7.62; 15 11.43,-7.62; 16 13.97,-7.62; 17 16.51,-7.62; 18 19.05,-7.62; 19 21.59,-7.62; 20 24.13,-7.62; 21 24.13,7.62; 22 21.59,7.62; 23 19.05,7.62; 24 16.51,7.62; 25 13.97,7.62; 26 11.43,7.62; 27 8.89,7.62; 28 6.35,7.62; 29 3.81,7.62; 30 1.27,7.62; 31 -1.27,7.62; 32 -3.81,7.62; 33 -6.35,7.62; 34 -8.89,7.62; 35 -11.43,7.62; 36 -13.97,7.62; 37 -16.51,7.62; 38 -19.05,7.62; 39 -21.59,7.62; 40 -24.13,7.62
JP1 = drill 0.914 long: 1 0,-1.27; 2 0,1.27
2X03 = drill 1.016 octagon: 1 -2.54,-1.27; 2 -2.54,1.27; 3 0,-1.27; 4 0,1.27; 5 2.54,-1.27; 6 2.54,1.27
LED3MM = drill 0.813 octagon: A -1.27,0; K 1.27,0
057-010-1 = drill 1 octagon: 1 -5.08,-1.27; 2 -5.08,1.27; 3 -2.54,-1.27; 4 -2.54,1.27; 5 0,-1.27; 6 0,1.27; 7 2.54,-1.27; 8 2.54,1.27; 9 5.08,-1.27; 10 5.08,1.27
HC49U-V = drill 0.813: 1 -2.413,0; 2 2.413,0
TO92 = drill 0.813 octagon: 1 1.27,0; 2 0,1.905; 3 -1.27,0
0207/7 = drill 0.813 octagon: 1 -3.81,0; 2 3.81,0
0207/10 = drill 0.813 octagon: 1 -5.08,0; 2 5.08,0
SJ = smd 1.168 x 1.6: 1 -0.762,0; 2 0.762,0
MA05-2 = drill 1.016 octagon: 1 -5.08,-1.27; 2 -5.08,1.27; 3 -2.54,-1.27; 4 -2.54,1.27; 5 0,-1.27; 6 0,1.27; 7 2.54,-1.27; 8 2.54,1.27; 9 5.08,-1.27; 10 5.08,1.27
BOARD = hole 3.5: 9,5; 9,95; 141,95; 141,5 | hole 1: 4,95; 146,5; 4,5; 146,95
CON_6 = drill 1 octagon: 1 -2.54,-1.27; 2 -2.54,1.27; 3 0,-1.27; 4 0,1.27; 5 2.54,-1.27; 6 2.54,1.27
CON_14 = drill 1 octagon: 1 -7.62,-1.27; 2 -7.62,1.27; 3 -5.08,-1.27; 4 -5.08,1.27; 5 -2.54,-1.27; 6 -2.54,1.27; 7 0,-1.27; 8 0,1.27; 9 2.54,-1.27; 10 2.54,1.27; 11 5.08,-1.27; 12 5.08,1.27; 13 7.62,-1.27; 14 7.62,1.27
F09HP = drill 1.016 octagon: 1 -5.486,-1.27; 2 -2.743,-1.27; 3 0,-1.27; 4 2.743,-1.27; 5 5.486,-1.27; 6 -4.115,1.27; 7 -1.372,1.27; 8 1.372,1.27; 9 4.115,1.27 | drill 3.302 pad 5.08: G1 -12.522,0; G2 12.522,0

### Placement (x,y rotation side)
C1  93.98,15.24 90 top
C2  88.9,15.24 270 top
C3  15.24,7.62 0 top
C4  15.24,12.7 0 top
C5  104.14,15.24 0 top
C6  124.46,10.16 0 top
C7  124.46,5.08 0 top
C8  22.86,63.5 90 top
C9  30.48,63.5 90 top
C10  38.1,63.5 90 top
C11  45.72,63.5 90 top
C12  88.9,55.88 270 top
C13  81.28,55.88 270 top
C14  76.2,55.88 270 top
C15  71.12,55.88 270 top
C16  66.04,55.88 270 top
C17  60.96,55.88 270 top
C18  0,-76.2 0 top  (outside the outline)
C19  0,-83.82 0 top  (outside the outline)
DC1  10.16,-53.34 0 top  (outside the outline)
IC1  43.18,10.16 270 top
IC3  35.56,73.66 0 top
IC4  86.36,40.64 0 top
IC10  10.16,-10.16 0 top  (outside the outline)
IC11  10.16,-22.86 0 top  (outside the outline)
JP1  40.64,81.28 90 top
JP2  -7.62,-81.28 0 top  (outside the outline)
LED1  76.2,83.82 90 top
LED2  81.28,83.82 90 top
LED3  86.36,83.82 90 top
LED4  91.44,83.82 90 top
LED5  96.52,83.82 90 top
LED6  101.6,83.82 90 top
LED7  106.68,83.82 90 top
LED8  111.76,83.82 90 top
LED9  116.84,83.82 90 top
LED10  121.92,83.82 90 top
LED11  127,83.82 90 top
LED12  0,-68.58 0 top  (outside the outline)
LEISTUNG  5.08,19.05 90 top
Q1  91.44,22.86 0 top
Q2  91.44,76.2 90 top
Q3  96.52,76.2 90 top
Q4  101.6,76.2 90 top
Q5  106.68,76.2 90 top
Q6  111.76,76.2 90 top
Q7  116.84,76.2 90 top
Q8  121.92,76.2 90 top
Q9  127,76.2 90 top
R1  86.36,93.98 90 top
R2  81.28,93.98 90 top
R3  76.2,93.98 90 top
R4  91.44,93.98 90 top
R5  96.52,93.98 90 top
R6  101.6,93.98 90 top
R7  106.68,93.98 90 top
R8  111.76,93.98 90 top
R9  116.84,20.32 0 top
R10  116.84,15.24 0 top
R11  116.84,25.4 0 top
R12  116.84,93.98 90 top
R13  121.92,93.98 90 top
R14  127,93.98 90 top
R15  27.94,-20.32 0 top  (outside the outline)
R16  5.08,-33.02 0 top  (outside the outline)
R17  17.78,-33.02 0 top  (outside the outline)
R25  30.48,-33.02 0 top  (outside the outline)
R26  5.08,-38.1 0 top  (outside the outline)
R27  17.78,-38.1 0 top  (outside the outline)
R28  30.48,-38.1 0 top  (outside the outline)
R29  5.08,-43.18 0 top  (outside the outline)
R30  17.78,-43.18 0 top  (outside the outline)
R31  30.48,-43.18 0 top  (outside the outline)
R32  5.08,-48.26 0 top  (outside the outline)
R33  17.78,-48.26 0 top  (outside the outline)
R34  5.08,-63.5 0 top  (outside the outline)
SJ1  91.44,68.58 90 top
SJ2  96.52,68.58 90 top
SJ3  101.6,68.58 90 top
SJ4  106.68,68.58 90 top
SJ5  111.76,68.58 90 top
SJ6  116.84,68.58 90 top
SJ7  121.92,68.58 90 top
SJ8  127,68.58 90 top
SV1  101.6,7.62 0 top
U$1  [BOARD]  0,0 0 top
U$2  144.78,65.28 90 top
U$3  144.78,43.18 90 top
X1  28.45,88.14 0 top

### Tracks (layer width: path | path; a pad name or v marks a point on that pad's centre or on a via)
5V_LST  (5 unrouted)
+3V3  (7 unrouted)
+5V  (22 unrouted)
+24V  (1 unrouted)
ACCEL_X  (2 unrouted)
ACCEL_Y  (2 unrouted)
BAT_-  (7 unrouted)
BAT_PWM_CTL  (3 unrouted)
BAT_PWM_LST  (1 unrouted)
DIRL_CTL  (2 unrouted)
DIRL_LST  (2 unrouted)
DIRR_CTL  (2 unrouted)
DIRR_LST  (2 unrouted)
ENABLE_CTL  (3 unrouted)
ENABLE_LST  (2 unrouted)
FOOT_SW_B  (2 unrouted)
GND  (52 unrouted)
  pour Bottom: -2.54,104.14 -2.54,-2.54 152.4,-2.54 152.4,101.6 152.4,104.14
GYRO_REF  (2 unrouted)
GYRO_X  (2 unrouted)
GYRO_Y  (2 unrouted)
MISO  (1 unrouted)
MOSI  (1 unrouted)
MOTOR_PWM_L_CTL  (2 unrouted)
MOTOR_PWM_L_LST  (1 unrouted)
MOTOR_PWM_LST  (1 unrouted)
MOTOR_PWM_R_CTL  (2 unrouted)
MOTOR_PWM_R_LST  (1 unrouted)
N$1  (1 unrouted)
N$2  (2 unrouted)
N$3  (2 unrouted)
N$4  (1 unrouted)
N$5  (1 unrouted)
N$6  (1 unrouted)
N$7  (1 unrouted)
N$8  (1 unrouted)
N$9  (1 unrouted)
N$10  (1 unrouted)
N$11  (1 unrouted)
N$14  (1 unrouted)
N$15  (1 unrouted)
N$16  (1 unrouted)
N$17  (1 unrouted)
N$18  (1 unrouted)
N$19  (1 unrouted)
N$20  (1 unrouted)
N$21  (1 unrouted)
N$22  (1 unrouted)
N$23  (1 unrouted)
N$24  (1 unrouted)
N$25  (1 unrouted)
N$26  (1 unrouted)
N$27  (1 unrouted)
N$28  (1 unrouted)
N$29  (1 unrouted)
N$30  (1 unrouted)
N$31  (1 unrouted)
N$32  (1 unrouted)
N$33  (1 unrouted)
N$34  (1 unrouted)
N$35  (1 unrouted)
N$36  (1 unrouted)
N$37  (1 unrouted)
N$38  (1 unrouted)
N$39  (1 unrouted)
N$40  (1 unrouted)
N$41  (1 unrouted)
N$42  (1 unrouted)
N$45  (1 unrouted)
N$46  (1 unrouted)
N$47  (2 unrouted)
POTI  (2 unrouted)
RESET  (3 unrouted)
RS232RX  (2 unrouted)
RS232RX_CON  (1 unrouted)
RS232TX  (2 unrouted)
RS232TX_CON  (1 unrouted)
RXD  (1 unrouted)
SCK  (1 unrouted)
STATUS_LED1  (1 unrouted)
STATUS_LED2  (1 unrouted)
STATUS_LED3  (1 unrouted)
TXD  (3 unrouted)